# Altium project BytePipe_x9002_HDK_Release_Rev2.PrjPcb (part 2 of 2)

## Sheet 5-DisplayPort & Ethernet.SchDoc: DisplayPort & Ethernet
size B; CompanyName: NGRF; Address1: 2130 Howard Drive W; Address2: North Mankato, MN 56003; Address3: www.nextgenrf.com; Revision: 2; SheetNumber: 5; SheetTotal: 7; ProjName: BytePipe X9002_HDK
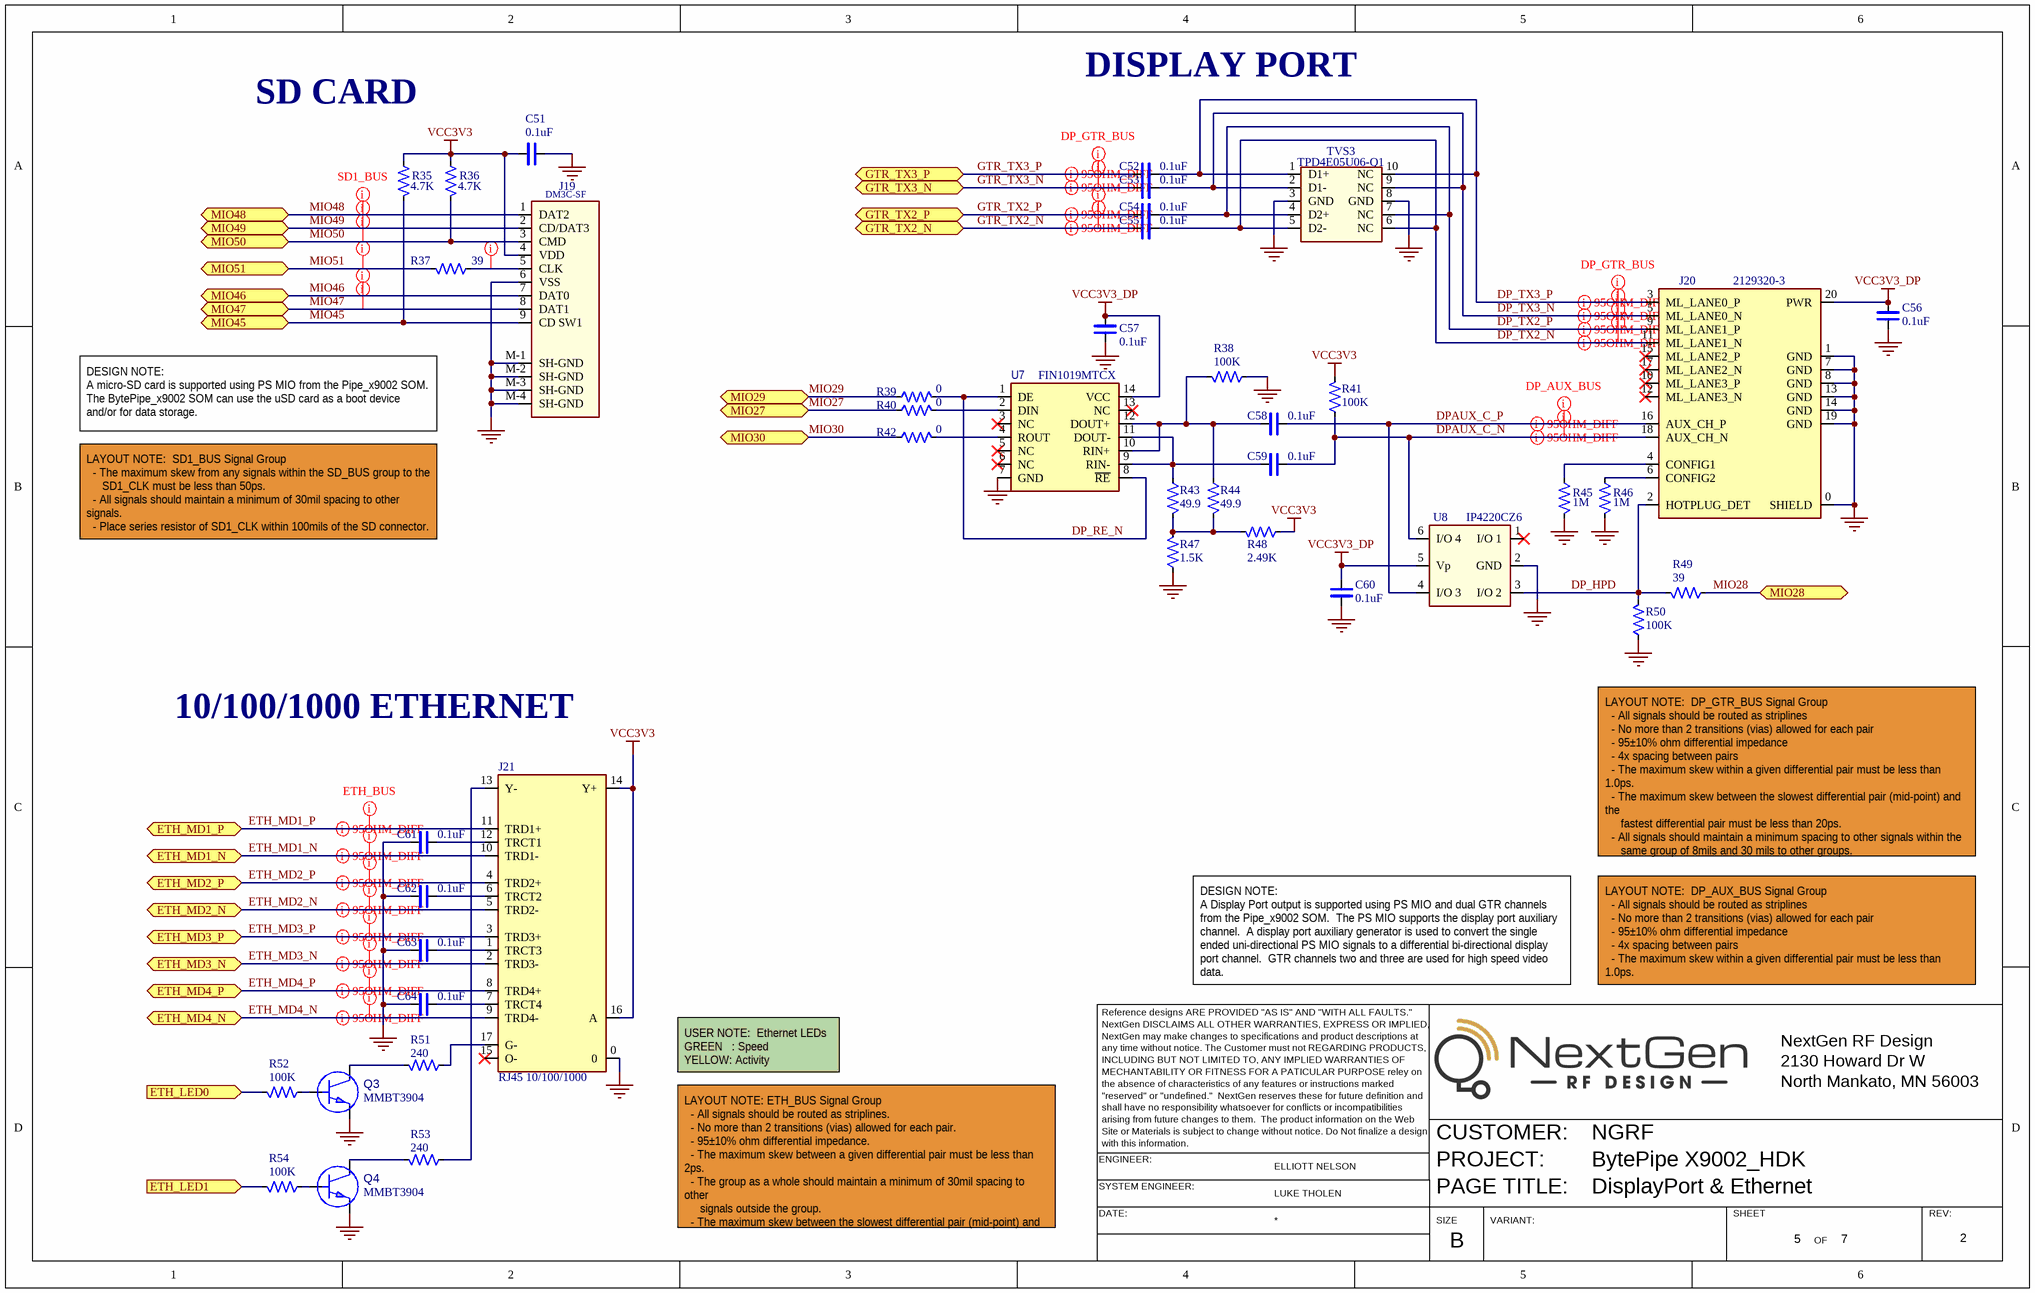
[diagram p4: 5-DisplayPort & Ethernet.SchDoc]

### Parts
C51  value 0.1uF  [SM/0402/CAP]  (hidden comment: CAP_CERAMIC_0402)
C52  value 0.1uF  [SM/0402/CAP]  (hidden comment: CAP_CERAMIC_0402)
C53  value 0.1uF  [SM/0402/CAP]  (hidden comment: CAP_CERAMIC_0402)
C54  value 0.1uF  [SM/0402/CAP]  (hidden comment: CAP_CERAMIC_0402)
C55  value 0.1uF  [SM/0402/CAP]  (hidden comment: CAP_CERAMIC_0402)
C56  value 0.1uF  [SM/0402/CAP]  (hidden comment: CAP_CERAMIC_0402)
C57  value 0.1uF  [SM/0402/CAP]  (hidden comment: CAP_CERAMIC_0402)
C58  value 0.1uF  [SM/0402/CAP]  (hidden comment: CAP_CERAMIC_0402)
C59  value 0.1uF  [SM/0402/CAP]  (hidden comment: CAP_CERAMIC_0402)
C60  value 0.1uF  [SM/0402/CAP]  (hidden comment: CAP_CERAMIC_0402)
C61  value 0.1uF  [SM/0402/CAP]  (hidden comment: CAP_CERAMIC_0402)
C62  value 0.1uF  [SM/0402/CAP]  (hidden comment: CAP_CERAMIC_0402)
C63  value 0.1uF  [SM/0402/CAP]  (hidden comment: CAP_CERAMIC_0402)
C64  value 0.1uF  [SM/0402/CAP]  (hidden comment: CAP_CERAMIC_0402)
J19  value DM3C-SF  [SM/CON/MICRO_SD-CARD/HOLDER]  (hidden comment: CONN MICRO SD CARD HINGED TYPE)
J20  value 2129320-3  [CON/TE/2129320-3]  (hidden comment: CON_TE_2129320-3)
J21  value RJ45 10/100/1000  [CON/RJ45/L829-1J1T-43]  (hidden comment: CON_RJ45_MagJack_L829-1J1T-43)
Q3  value MMBT3904  [SM/SOT23_A]  (hidden comment: TRANSISTOR_NPN_SOT23)
Q4  value MMBT3904  [SM/SOT23_A]  (hidden comment: TRANSISTOR_NPN_SOT23)
R35  value 4.7K  [SM/0402/RES]  (hidden comment: RES_0402_A)
R36  value 4.7K  [SM/0402/RES]  (hidden comment: RES_0402_A)
R37  value 39  [SM/0402/RES]  (hidden comment: RES_0402_A)
R38  value 100K  [SM/0402/RES]  (hidden comment: RES_0402_A)
R39  value 0  [SM/0402/RES]  (hidden comment: RES_0402_A)
R40  value 0  [SM/0402/RES]  (hidden comment: RES_0402_A)
R41  value 100K  [SM/0402/RES]  (hidden comment: RES_0402_A)
R42  value 0  [SM/0402/RES]  (hidden comment: RES_0402_A)
R43  value 49.9  [SM/0402/RES]  (hidden comment: RES_0402_A)
R44  value 49.9  [SM/0402/RES]  (hidden comment: RES_0402_A)
R45  value 1M  [SM/0402/RES]  (hidden comment: RES_0402_A)
R46  value 1M  [SM/0402/RES]  (hidden comment: RES_0402_A)
R47  value 1.5K  [SM/0402/RES]  (hidden comment: RES_0402_A)
R48  value 2.49K  [SM/0402/RES]  (hidden comment: RES_0402_A)
R49  value 39  [SM/0402/RES]  (hidden comment: RES_0402_A)
R50  value 100K  [SM/0402/RES]  (hidden comment: RES_0402_A)
R51  value 240  [SM/0402/RES]  (hidden comment: RES_0402_A)
R52  value 100K  [SM/0402/RES]  (hidden comment: RES_0402_A)
R53  value 240  [SM/0402/RES]  (hidden comment: RES_0402_A)
R54  value 100K  [SM/0402/RES]  (hidden comment: RES_0402_A)
TVS3  value TPD4E05U06-Q1  [SM/DFN10/2.5X1MM_A]  (hidden comment: TVS_TPD4E05U06_2.5mmX1mm)
U7  value FIN1019MTCX  [SM/TSSOP14_5X6.4MM_A]  (hidden comment: IC_FIN1019MTCX_TSSOP-14)
U8  value IP4220CZ6  [SM/TSOP-6_A]  (hidden comment: IC_IP4220CZ6_TSOP-6)

### Ports
ETH_LED0 (in), ETH_LED1 (in), ETH_MD1_N (bidir), ETH_MD1_P (bidir), ETH_MD2_N (bidir), ETH_MD2_P (bidir), ETH_MD3_N (bidir), ETH_MD3_P (bidir), ETH_MD4_N (bidir), ETH_MD4_P (bidir), GTR_TX2_N (bidir), GTR_TX2_P (bidir), GTR_TX3_N (bidir), GTR_TX3_P (bidir), MIO27 (bidir), MIO28 (bidir), MIO29 (bidir), MIO30 (bidir), MIO45 (bidir), MIO46 (bidir), MIO47 (bidir), MIO48 (bidir), MIO49 (bidir), MIO50 (bidir), MIO51 (bidir)

### Nets
GND: C51.2(N2) C56.2(N2) C57.2(N2) C60.2(N2) C61.1(N1) C62.1(N1) C63.1(N1) C64.1(N1) J19.6(VSS) J19.M-1(SH-GND) J19.M-2(SH-GND) J19.M-3(SH-GND) J19.M-4(SH-GND) J20.0(SHIELD) J20.1(GND) J20.7(GND) J20.8(GND) J20.13(GND) J20.14(GND) J20.19(GND) J21.0 Q3.2(E) Q4.2(E) R38.1 R45.2 R46.2 R47.1 R50.1 TVS3.3(GND) TVS3.8(GND) U7.7(GND) U8.2(GND)
VCC3V3: C51.1(N1) J19.4(VDD) J21.14(Y+) J21.16(A) R35.1 R36.1 R41.2 R48.1
VCC3V3_DP: C56.1(N1) C57.1(N1) C60.1(N1) J20.20(PWR) U7.14(VCC) U8.5(Vp)
DP_HPD: J20.2(HOTPLUG_DET) R49.2 R50.2 U8.3(I/O_2)
DP_RE_N: R39.1 U7.1(DE) U7.8(~{RE})
DP_TX2_N: C55.2(N2) J20.11(ML_LANE1_N) TVS3.5(D2-) TVS3.6(NC)
DP_TX2_P: C54.2(N2) J20.9(ML_LANE1_P) TVS3.4(D2+) TVS3.7(NC)
DP_TX3_N: C53.2(N2) J20.5(ML_LANE0_N) TVS3.2(D1-) TVS3.9(NC)
DP_TX3_P: C52.2(N2) J20.3(ML_LANE0_P) TVS3.1(D1+) TVS3.10(NC)
DPAUX_C_N: C59.2(N2) J20.18(AUX_CH_N) R41.1 U8.6(I/O_4)
DPAUX_C_P: C58.2(N2) J20.16(AUX_CH_P) U8.4(I/O_3)
ETH_LED0: R52.2 ; port ETH_LED0
ETH_LED1: R54.2 ; port ETH_LED1
ETH_MD1_N: J21.10(TRD1-) ; port ETH_MD1_N
ETH_MD1_P: J21.11(TRD1+) ; port ETH_MD1_P
ETH_MD2_N: J21.5(TRD2-) ; port ETH_MD2_N
ETH_MD2_P: J21.4(TRD2+) ; port ETH_MD2_P
ETH_MD3_N: J21.2(TRD3-) ; port ETH_MD3_N
ETH_MD3_P: J21.3(TRD3+) ; port ETH_MD3_P
ETH_MD4_N: J21.9(TRD4-) ; port ETH_MD4_N
ETH_MD4_P: J21.8(TRD4+) ; port ETH_MD4_P
GTR_TX2_N: C55.1(N1) ; port GTR_TX2_N
GTR_TX2_P: C54.1(N1) ; port GTR_TX2_P
GTR_TX3_N: C53.1(N1) ; port GTR_TX3_N
GTR_TX3_P: C52.1(N1) ; port GTR_TX3_P
MIO27: R40.2 ; port MIO27
MIO28: R49.1 ; port MIO28
MIO29: R39.2 ; port MIO29
MIO30: R42.2 ; port MIO30
MIO45: J19.9(CD_SW1) R35.2 ; port MIO45
MIO46: J19.7(DAT0) ; port MIO46
MIO47: J19.8(DAT1) ; port MIO47
MIO48: J19.1(DAT2) ; port MIO48
MIO49: J19.2(CD/DAT3) ; port MIO49
MIO50: J19.3(CMD) R36.2 ; port MIO50
MIO51: R37.2 ; port MIO51
NetC58_1: C58.1(N1) R38.2 R44.1 U7.10(RIN+) U7.12(DOUT+)
NetC59_1: C59.1(N1) R43.1 U7.9(RIN-) U7.11(DOUT-)
NetC61_2: C61.2(N2) J21.12(TRCT1)
NetC62_2: C62.2(N2) J21.6(TRCT2)
NetC63_2: C63.2(N2) J21.1(TRCT3)
NetC64_2: C64.2(N2) J21.7(TRCT4)
NetJ19_5: J19.5(CLK) R37.1
NetJ20_4: J20.4(CONFIG1) R45.1
NetJ20_6: J20.6(CONFIG2) R46.1
NetJ21_13: J21.13(Y-) R53.2
NetJ21_17: J21.17(G-) R51.2
NetQ3_1: Q3.1(B) R52.1
NetQ3_3: Q3.3(C) R51.1
NetQ4_1: Q4.1(B) R54.1
NetQ4_3: Q4.3(C) R53.1
NetR40_1: R40.1 U7.2(DIN)
NetR42_1: R42.1 U7.4(ROUT)
NetR43_2: R43.2 R44.2 R47.2 R48.2

Not connected (* = marked no-connect by the designer): J20 10(ML_LANE3_P)* 12(ML_LANE3_N)* 15(ML_LANE2_P)* 17(ML_LANE2_N)*; J21 15(O-)*; U7 3(NC)* 5(NC)* 6(NC)* 13(NC)*; U8 1(I/O_1)*

### Layout directives
net class DP_GTR_BUS: DP_TX2_N, DP_TX2_P, DP_TX3_N, DP_TX3_P, GTR_TX2_N, GTR_TX2_P, GTR_TX3_N, GTR_TX3_P
net class DP_AUX_BUS: DPAUX_C_N, DPAUX_C_P
differential pair; Impedance: 90 Ohms; differential pair class 95OHM_DIFF: DP_TX2_N, DP_TX2_P, DP_TX3_N, DP_TX3_P, DPAUX_C_N, DPAUX_C_P, ETH_MD1_N, ETH_MD1_P, ETH_MD2_N, ETH_MD2_P, ETH_MD3_N, ETH_MD3_P, ETH_MD4_N, ETH_MD4_P, GTR_TX2_N, GTR_TX2_P, GTR_TX3_N, GTR_TX3_P
net class ETH_BUS: ETH_MD1_N, ETH_MD1_P, ETH_MD2_N, ETH_MD2_P, ETH_MD3_N, ETH_MD3_P, ETH_MD4_N, ETH_MD4_P
net class SD1_BUS: MIO46, MIO47, MIO48, MIO49, MIO50, MIO51, NetJ19_5

### Notes on the sheet
- DISPLAY PORT
- SD CARD
- DESIGN NOTE:
  A micro-SD card is supported using PS MIO from the Pipe_x9002 SOM.  The BytePipe_x9002 SOM can use the uSD card as a boot device and/or for data storage.
- LAYOUT NOTE:  SD1_BUS Signal Group
  - The maximum skew from any signals within the SD_BUS group to the
  SD1_CLK must be less than 50ps.
  - All signals should maintain a minimum of 30mil spacing to other signals.
  - Place series resistor of SD1_CLK within 100mils of the SD connector.
  -MIO51 is SD1_CLK.
- 10/100/1000 ETHERNET
- (near R50) LAYOUT NOTE:  DP_GTR_BUS Signal Group
  - All signals should be routed as striplines
  - No more than 2 transitions (vias) allowed for each pair
  - 95±10% ohm differential impedance
  - 4x spacing between pairs
  - The maximum skew within a given differential pair must be less than 1.0ps.
  - The maximum skew between the slowest differential pair (mid-point) and the
  fastest differential pair must be less than 20ps.
  - All signals should maintain a minimum spacing to other signals within the
  same group of 8mils and 30 mils to other groups.
  - All signals within the group should be routed on the same layer.
- Reference designs ARE PROVIDED "AS IS" AND "WITH ALL FAULTS."
- NextGen DISCLAIMS ALL OTHER WARRANTIES, EXPRESS OR IMPLIED,
- NextGen may make changes to specifications and product descriptions at
- DESIGN NOTE:
  A Display Port output is supported using PS MIO and dual GTR channels from the Pipe_x9002 SOM.  The PS MIO supports the display port auxiliary channel.  A display port auxiliary generator is used to convert the single ended uni-directional PS MIO signals to a differential bi-directional display port channel.  GTR channels two and three are used for high speed video data.
- LAYOUT NOTE:  DP_AUX_BUS Signal Group
  - All signals should be routed as striplines
  - No more than 2 transitions (vias) allowed for each pair
  - 95±10% ohm differential impedance
  - 4x spacing between pairs
  - The maximum skew within a given differential pair must be less than 1.0ps.
- NextGen RF Design
- USER NOTE:  Ethernet LEDs
  GREEN   : Speed
  YELLOW: Activity
- any time without notice. The Customer must not REGARDING PRODUCTS,
- INCLUDING BUT NOT LIMITED TO, ANY IMPLIED WARRANTIES OF
- MECHANTABILITY OR FITNESS FOR A PATICULAR PURPOSE reley on
- "reserved" or "undefined."  NextGen reserves these for future definition and
- the absence of characteristics of any features or instructions marked
- shall have no responsibility whatsoever for conflicts or incompatibilities
- 2130 Howard Dr W
- North Mankato, MN 56003
- ENGINEER:
- Site or Materials is subject to change without notice. Do Not finalize a design
- with this information.
- arising from future changes to them.  The product information on the Web
- ELLIOTT NELSON
- CUSTOMER:
- PROJECT:
- LAYOUT NOTE: ETH_BUS Signal Group
  - All signals should be routed as striplines.
  - No more than 2 transitions (vias) allowed for each pair.
  - 95±10% ohm differential impedance.
  - The maximum skew between a given differential pair must be less than 2ps.
  - The group as a whole should maintain a minimum of 30mil spacing to other
  signals outside the group.
  - The maximum skew between the slowest differential pair (mid-point) and the
  fastest differential pair of the signal group must be less than 10ps.
- SYSTEM ENGINEER:
- DATE:
- LUKE THOLEN
- SIZE
- PAGE TITLE:
- VARIANT:
- SHEET
- OF
- REV:
- B

### Library data of the parts
C51-C64 = CAP_CERAMIC_0402: CAP CER 0.1UF 25V X7R 0402; TOL: ±10%; OEM#: CL05B104KA5NNNC; OEM NAME: Samsung; VOLT: 25V
J19 = CON_HIROSE_MICRO-SD_HINGED: 10 (8 + 2) Position Card Connector Secure Digital - microSD™ Surface Mount, Right Angle Gold; OEM NAME: Hirose Electric Co Ltd; OEM#: DM3C-SF
J20 = CON_TE_2129320-3: DisplayPort, Mini  Receptacle Connector 20 Position Through Hole, Right Angle..; OEM NAME: TE; OEM#: 2129320-3
J21 = CON_RJ45_MagJack_L829-1J1T-43: 1 Port RJ45 Magjack Connector Through Hole 10/100/1000 Base-T, AutoMDIX; OEM NAME: Bel Fuse Inc; OEM#: L829-1J1T-43
Q3 Q4 = TRANSISTOR_NPN_SOT23: Bipolar (BJT) Transistor NPN 40V 200mA 300MHz 300mW Surface Mount SOT-23-3 (TO-236); OEM#: MMBT3904LT1G; OEM NAME: ON Semiconductor
R35 R36 = RES_0402_A: RES SMD 4.7K OHM 1% 1/10W 0402; OEM#: ERJ-2RKF4701X; OEM NAME: Panasonic; TOL: 1%
R37 R49 = RES_0402_A: RES SMD 39 OHM 1% 1/10W 0402; OEM#: ERJ-2RKF39R0X; OEM NAME: Panasonic; TOL: 1%
R38 R41 R50 R52 R54 = RES_0402_A: RES SMD 100K OHM 1% 1/10W 0402; OEM#: ERJ-2RKF1003X; OEM NAME: Panasonic; TOL: 1%
R39 R40 R42 = RES_0402_A: RES SMD 0 OHM JUMPER 1/10W 0402; OEM#: ERJ-2GE0R00X; OEM NAME: Panasonic; TOL: 1%
R43 R44 = RES_0402_A: RES 49.9 OHM 1% 1/10W 0402; OEM#: ERJ-2RKF49R9X; OEM NAME: Panasonic; TOL: ±1%
R45 R46 = RES_0402_A: RES SMD 1M OHM 1% 1/10W 0402; OEM#: ERJ-2RKF1004X; OEM NAME: Panasonic; TOL: ±1%
R47 = RES_0402_A: RES SMD 1.5K OHM 1% 1/10W 0402; OEM#: ERJ-2RKF1501X; OEM NAME: Panasonic; TOL: ±1%
R48 = RES_0402_A: RES SMD 2.49K OHM 1% 1/10W 0402; OEM#: ERJ-2RKF2491X; OEM NAME: Panasonic; TOL: ±1%
R51 R53 = RES_0402_A: RES SMD 240 OHM 1% 1/10W 0402; OEM#: ERJ-2RKF2400X; OEM NAME: Panasonic; TOL: 1%
TVS3 = TVS_TPD4E05U06_2.5mmX1mm: TVS DIODE 5.5V 14V 10SON; OEM NAME: TI; OEM#: TPD4E05U06-Q1
U7 = IC_FIN1019MTCX_TSSOP-14: 1/1 Transceiver Full LVDS 14-TSSOP; OEM NAME: ON Semiconductor; OEM#: FIN1019MTCX
U8 = IC_IP4220CZ6_TSOP-6: Dual USB ESD Protection; OEM#: IP4220CZ6,125; OEM NAME: NXP

## Sheet 6-User IO.SchDoc: User I/O
size B; CompanyName: NGRF; Address1: 2130 Howard Drive W; Address2: North Mankato, MN 56003; Address3: www.nextgenrf.com; Revision: 2; SheetNumber: 6; SheetTotal: 7; ProjName: BytePipe X9002_HDK
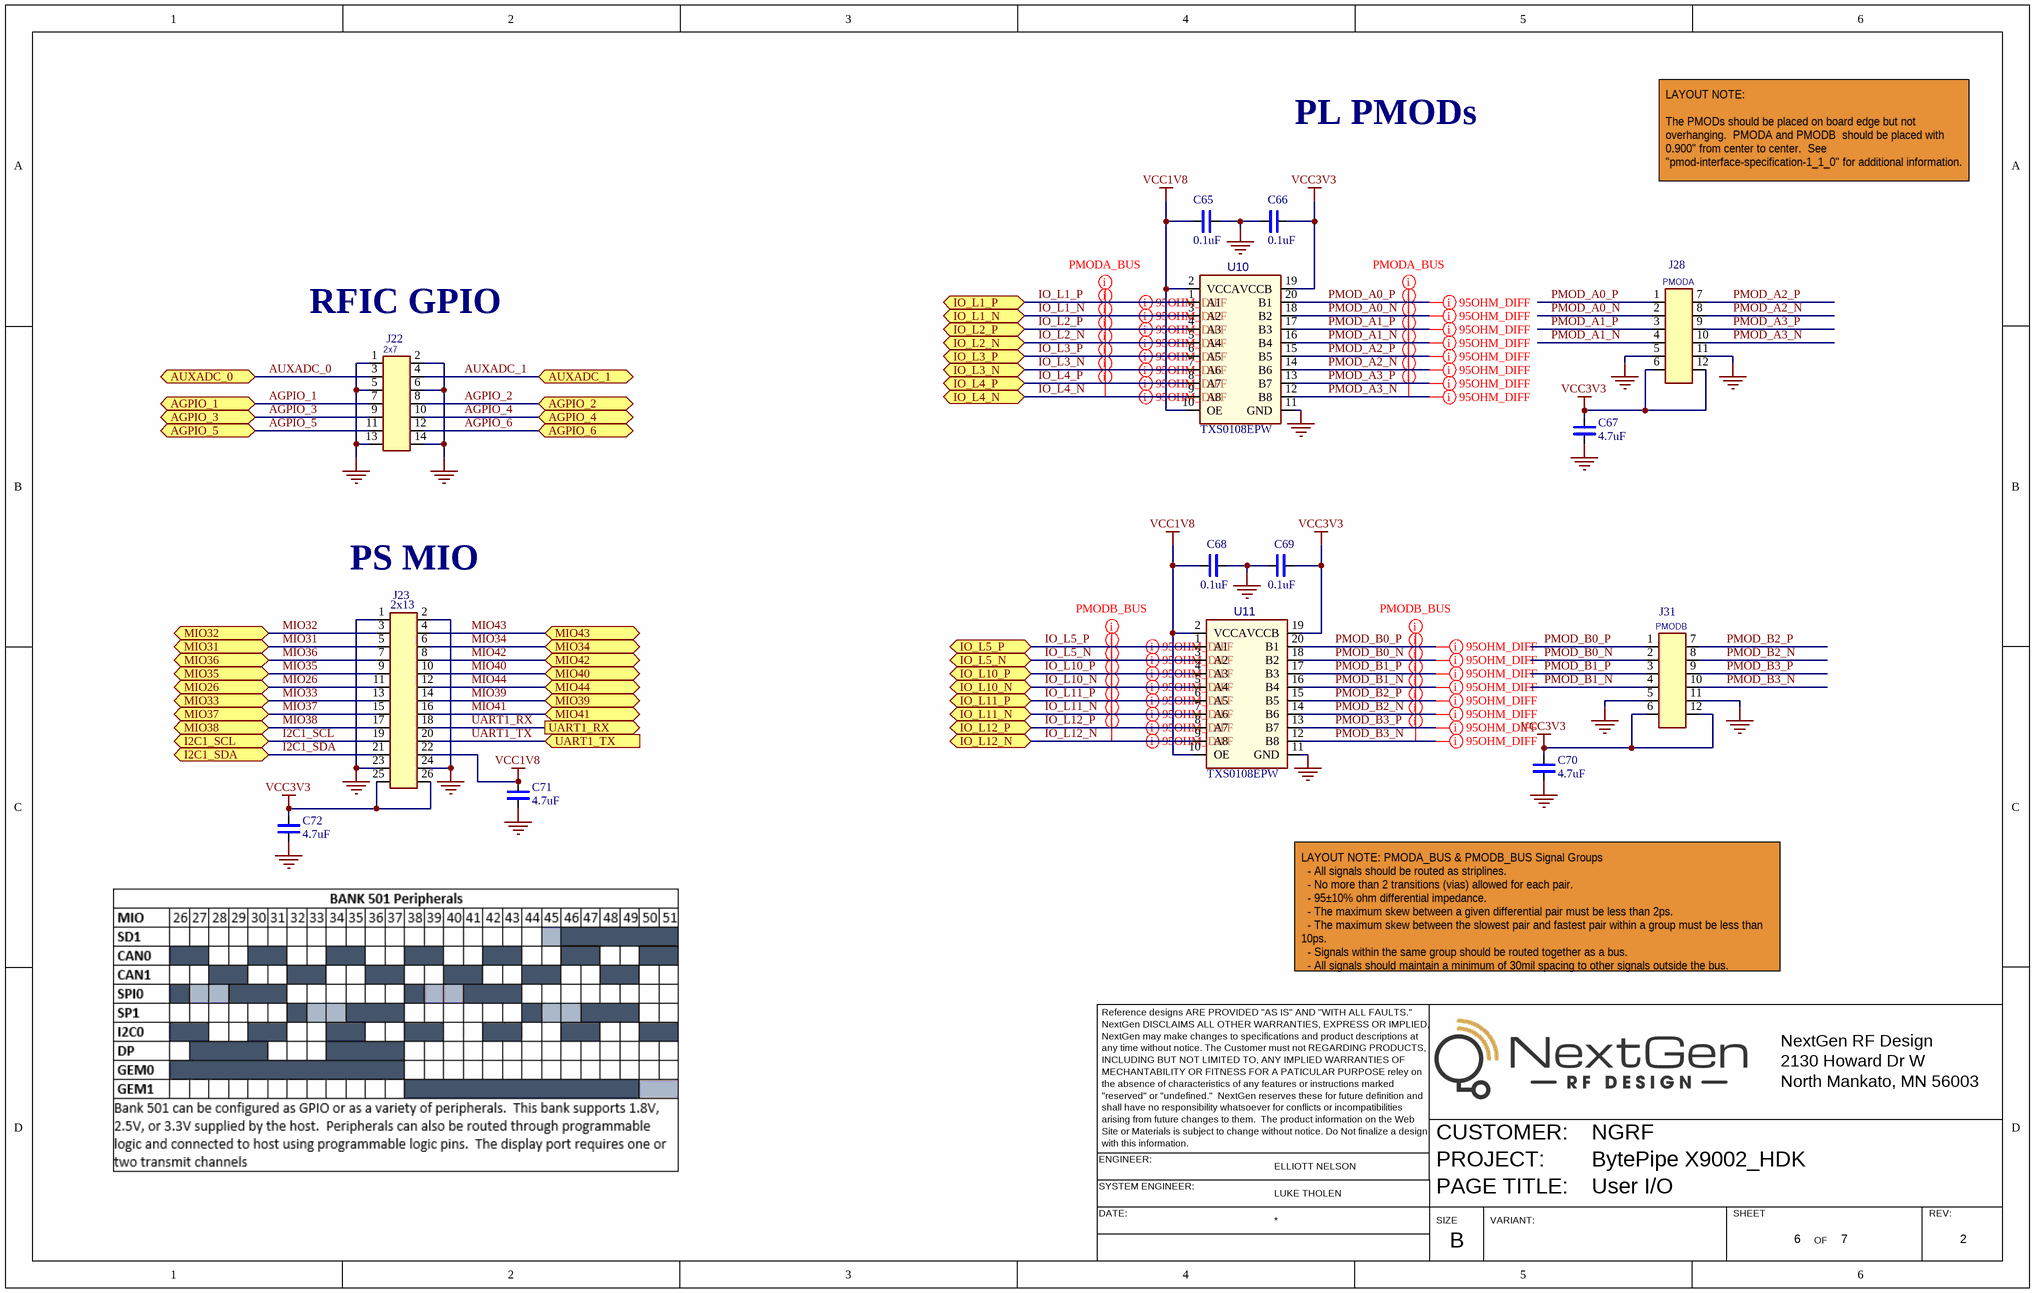
[diagram p5: 6-User IO.SchDoc]

### Parts
C65  value 0.1uF  [SM/0402/CAP]  (hidden comment: CAP_CERAMIC_0402)
C66  value 0.1uF  [SM/0402/CAP]  (hidden comment: CAP_CERAMIC_0402)
C67  value 4.7uF  [SM/0402/CAP]  (hidden comment: CAP_CERAMIC_0402)
C68  value 0.1uF  [SM/0402/CAP]  (hidden comment: CAP_CERAMIC_0402)
C69  value 0.1uF  [SM/0402/CAP]  (hidden comment: CAP_CERAMIC_0402)
C70  value 4.7uF  [SM/0402/CAP]  (hidden comment: CAP_CERAMIC_0402)
C71  value 4.7uF  [SM/0402/CAP]  (hidden comment: CAP_CERAMIC_0402)
C72  value 4.7uF  [SM/0402/CAP]  (hidden comment: CAP_CERAMIC_0402)
J22  value 2x7  [CON/100SP/2X7P/VT/038_A]  (hidden comment: CON_100SP_2X7P_VT)
J23  value 2x13  [CON/100SP/2X13P/038_A]  (hidden comment: CON_100SP_2X13P_VERT)
J28  value PMODA  [CON/SAMTEC/SSW/2X6/RA_A/PMOD]  (hidden comment: CON_100SP_2X6P_RA_PMOD)
J31  value PMODB  [CON/SAMTEC/SSW/2X6/RA_A/PMOD]  (hidden comment: CON_100SP_2X6P_RA_PMOD)
U10  value TXS0108EPW  [SM/TSSOP20_6.5X6.4MM]  (hidden comment: IC_TXS0108_TSSOP-20)
U11  value TXS0108EPW  [SM/TSSOP20_6.5X6.4MM]  (hidden comment: IC_TXS0108_TSSOP-20)

### Ports
AGPIO_1 (bidir), AGPIO_2 (bidir), AGPIO_3 (bidir), AGPIO_4 (bidir), AGPIO_5 (bidir), AGPIO_6 (bidir), AUXADC_0 (bidir), AUXADC_1 (bidir), I2C1_SCL (bidir), I2C1_SDA (bidir), IO_L1_N (bidir), IO_L1_P (bidir), IO_L2_N (bidir), IO_L2_P (bidir), IO_L3_N (bidir), IO_L3_P (bidir), IO_L4_N (bidir), IO_L4_P (bidir), IO_L5_N (bidir), IO_L5_P (bidir), IO_L10_N (bidir), IO_L10_P (bidir), IO_L11_N (bidir), IO_L11_P (bidir), IO_L12_N (bidir), IO_L12_P (bidir), MIO26 (bidir), MIO31 (bidir), MIO32 (bidir), MIO33 (bidir), MIO34 (bidir), MIO35 (bidir), MIO36 (bidir), MIO37 (bidir), MIO38 (bidir), MIO39 (bidir), MIO40 (bidir), MIO41 (bidir), MIO42 (bidir), MIO43 (bidir), MIO44 (bidir), UART1_RX (out), UART1_TX (in)

### Nets
GND: C65.2(N2) C66.1(N1) C67.2(N2) C68.2(N2) C69.1(N1) C70.2(N2) C71.2(N2) C72.2(N2) J22.1(N1) J22.2(N2) J22.5(N5) J22.6(N6) J22.13(N13) J22.14(N14) J23.1(N1) J23.2(N2) J23.23(N23) J23.24(N24) J28.5(N5) J28.11(N11) J31.5(N5) J31.11(N11) U10.11(GND) U11.11(GND)
VCC1V8: C65.1(N1) C68.1(N1) C71.1(N1) J23.22(N22) U10.2(VCCA) U10.10(OE) U11.2(VCCA) U11.10(OE)
VCC3V3: C66.2(N2) C67.1(N1) C69.2(N2) C70.1(N1) C72.1(N1) J23.25(N25) J23.26(N26) J28.6(N6) J28.12(N12) J31.6(N6) J31.12(N12) U10.19(VCCB) U11.19(VCCB)
AGPIO_1: J22.7(N7) ; port AGPIO_1
AGPIO_2: J22.8(N8) ; port AGPIO_2
AGPIO_3: J22.9(N9) ; port AGPIO_3
AGPIO_4: J22.10(N10) ; port AGPIO_4
AGPIO_5: J22.11(N11) ; port AGPIO_5
AGPIO_6: J22.12(N12) ; port AGPIO_6
AUXADC_0: J22.3(N3) ; port AUXADC_0
AUXADC_1: J22.4(N4) ; port AUXADC_1
I2C1_SCL: J23.19(N19) ; port I2C1_SCL
I2C1_SDA: J23.21(N21) ; port I2C1_SDA
IO_L1_N: U10.3(A2) ; port IO_L1_N
IO_L1_P: U10.1(A1) ; port IO_L1_P
IO_L2_N: U10.5(A4) ; port IO_L2_N
IO_L2_P: U10.4(A3) ; port IO_L2_P
IO_L3_N: U10.7(A6) ; port IO_L3_N
IO_L3_P: U10.6(A5) ; port IO_L3_P
IO_L4_N: U10.9(A8) ; port IO_L4_N
IO_L4_P: U10.8(A7) ; port IO_L4_P
IO_L5_N: U11.3(A2) ; port IO_L5_N
IO_L5_P: U11.1(A1) ; port IO_L5_P
IO_L10_N: U11.5(A4) ; port IO_L10_N
IO_L10_P: U11.4(A3) ; port IO_L10_P
IO_L11_N: U11.7(A6) ; port IO_L11_N
IO_L11_P: U11.6(A5) ; port IO_L11_P
IO_L12_N: U11.9(A8) ; port IO_L12_N
IO_L12_P: U11.8(A7) ; port IO_L12_P
MIO26: J23.11(N11) ; port MIO26
MIO31: J23.5(N5) ; port MIO31
MIO32: J23.3(N3) ; port MIO32
MIO33: J23.13(N13) ; port MIO33
MIO34: J23.6(N6) ; port MIO34
MIO35: J23.9(N9) ; port MIO35
MIO36: J23.7(N7) ; port MIO36
MIO37: J23.15(N15) ; port MIO37
MIO38: J23.17(N17) ; port MIO38
MIO39: J23.14(N14) ; port MIO39
MIO40: J23.10(N10) ; port MIO40
MIO41: J23.16(N16) ; port MIO41
MIO42: J23.8(N8) ; port MIO42
MIO43: J23.4(N4) ; port MIO43
MIO44: J23.12(N12) ; port MIO44
PMOD_A0_N: J28.2(N2) U10.18(B2)
PMOD_A0_P: J28.1(N1) U10.20(B1)
PMOD_A1_N: J28.4(N4) U10.16(B4)
PMOD_A1_P: J28.3(N3) U10.17(B3)
PMOD_A2_N: J28.8(N8) U10.14(B6)
PMOD_A2_P: J28.7(N7) U10.15(B5)
PMOD_A3_N: J28.10(N10) U10.12(B8)
PMOD_A3_P: J28.9(N9) U10.13(B7)
PMOD_B0_N: J31.2(N2) U11.18(B2)
PMOD_B0_P: J31.1(N1) U11.20(B1)
PMOD_B1_N: J31.4(N4) U11.16(B4)
PMOD_B1_P: J31.3(N3) U11.17(B3)
PMOD_B2_N: J31.8(N8) U11.14(B6)
PMOD_B2_P: J31.7(N7) U11.15(B5)
PMOD_B3_N: J31.10(N10) U11.12(B8)
PMOD_B3_P: J31.9(N9) U11.13(B7)
UART1_RX: J23.18(N18) ; port UART1_RX
UART1_TX: J23.20(N20) ; port UART1_TX

### Layout directives
net class PMODA_BUS: IO_L1_N, IO_L1_P, IO_L2_N, IO_L2_P, IO_L3_N, IO_L3_P, IO_L4_N, IO_L4_P, PMOD_A0_N, PMOD_A0_P, PMOD_A1_N, PMOD_A1_P, PMOD_A2_N, PMOD_A2_P, PMOD_A3_N, PMOD_A3_P
differential pair; Impedance: 90 Ohms; differential pair class 95OHM_DIFF: IO_L1_N, IO_L1_P, IO_L2_N, IO_L2_P, IO_L3_N, IO_L3_P, IO_L4_N, IO_L4_P, IO_L5_N, IO_L5_P, IO_L10_N, IO_L10_P, IO_L11_N, IO_L11_P, IO_L12_N, IO_L12_P, PMOD_A0_N, PMOD_A0_P, PMOD_A1_N, PMOD_A1_P, PMOD_A2_N, PMOD_A2_P, PMOD_A3_N, PMOD_A3_P, PMOD_B0_N, PMOD_B0_P, PMOD_B1_N, PMOD_B1_P, PMOD_B2_N, PMOD_B2_P, PMOD_B3_N, PMOD_B3_P
net class PMODB_BUS: IO_L5_N, IO_L5_P, IO_L10_N, IO_L10_P, IO_L11_N, IO_L11_P, IO_L12_N, IO_L12_P, PMOD_B0_N, PMOD_B0_P, PMOD_B1_N, PMOD_B1_P, PMOD_B2_N, PMOD_B2_P, PMOD_B3_N, PMOD_B3_P

### Notes on the sheet
- PL PMODs
- LAYOUT NOTE:
  The PMODs should be placed on board edge but not overhanging.  PMODA and PMODB  should be placed with 0.900" from center to center.  See "pmod-interface-specification-1_1_0" for additional information.
- (near J22) RFIC GPIO
- (near J23) PS MIO
- LAYOUT NOTE: PMODA_BUS & PMODB_BUS Signal Groups
  - All signals should be routed as striplines.
  - No more than 2 transitions (vias) allowed for each pair.
  - 95±10% ohm differential impedance.
  - The maximum skew between a given differential pair must be less than 2ps.
  - The maximum skew between the slowest pair and fastest pair within a group must be less than 10ps.
  - Signals within the same group should be routed together as a bus.
  - All signals should maintain a minimum of 30mil spacing to other signals outside the bus.
- Reference designs ARE PROVIDED "AS IS" AND "WITH ALL FAULTS."
- NextGen DISCLAIMS ALL OTHER WARRANTIES, EXPRESS OR IMPLIED,
- NextGen may make changes to specifications and product descriptions at
- NextGen RF Design
- any time without notice. The Customer must not REGARDING PRODUCTS,
- INCLUDING BUT NOT LIMITED TO, ANY IMPLIED WARRANTIES OF
- MECHANTABILITY OR FITNESS FOR A PATICULAR PURPOSE reley on
- "reserved" or "undefined."  NextGen reserves these for future definition and
- the absence of characteristics of any features or instructions marked
- shall have no responsibility whatsoever for conflicts or incompatibilities
- 2130 Howard Dr W
- North Mankato, MN 56003
- ENGINEER:
- Site or Materials is subject to change without notice. Do Not finalize a design
- with this information.
- arising from future changes to them.  The product information on the Web
- ELLIOTT NELSON
- CUSTOMER:
- PROJECT:
- SYSTEM ENGINEER:
- DATE:
- LUKE THOLEN
- SIZE
- PAGE TITLE:
- VARIANT:
- SHEET
- OF
- REV:
- B

### Library data of the parts
C65 C66 C68 C69 = CAP_CERAMIC_0402: as C51-C64 on sheet 5-DisplayPort & Ethernet; VOLT: 25V
C67 C70-C72 = CAP_CERAMIC_0402: CAP CER 4.7UF 10V X5R 0402; TOL: ±20%; OEM#: CL05A475MP5NRNC; OEM NAME: Samsung; VOLT: 10V
J22 = CON_100SP_2X7P_VT: Connector Header Through Hole 14 position 0.100" (2.54mm); OEM#: 2011-2X07TSB; OEM NAME: Harwin Inc.
J23 = CON_100SP_2X13P_VERT: PIN HEADER, DOUBLE ROW 26 PIN, S; OEM#: M20-9981345; OEM NAME: Harwin Inc.
J28 J31 = CON_100SP_2X6P_RA_PMOD: Header, 100 mil, 2x6, Right Angle, PMOD pin out.; OEM#: SSW-106-02-T-D-RA; OEM NAME: SAMTEC
U10 U11 = IC_TXS0108_TSSOP-20: IC TRNSLTR BIDIRECTIONAL 20VQFN; OEM NAME: Texas Instruments; OEM#: TXS0108EPW

## Sheet 7-JTAG & Power.SchDoc: JTAG & Power
size B; CompanyName: NGRF; Address1: 2130 Howard Drive W; Address2: North Mankato, MN 56003; Address3: www.nextgenrf.com; Revision: 2; SheetNumber: 7; SheetTotal: 7; ProjName: BytePipe X9002_HDK; SystemEngineer: ELLIOT NELSON
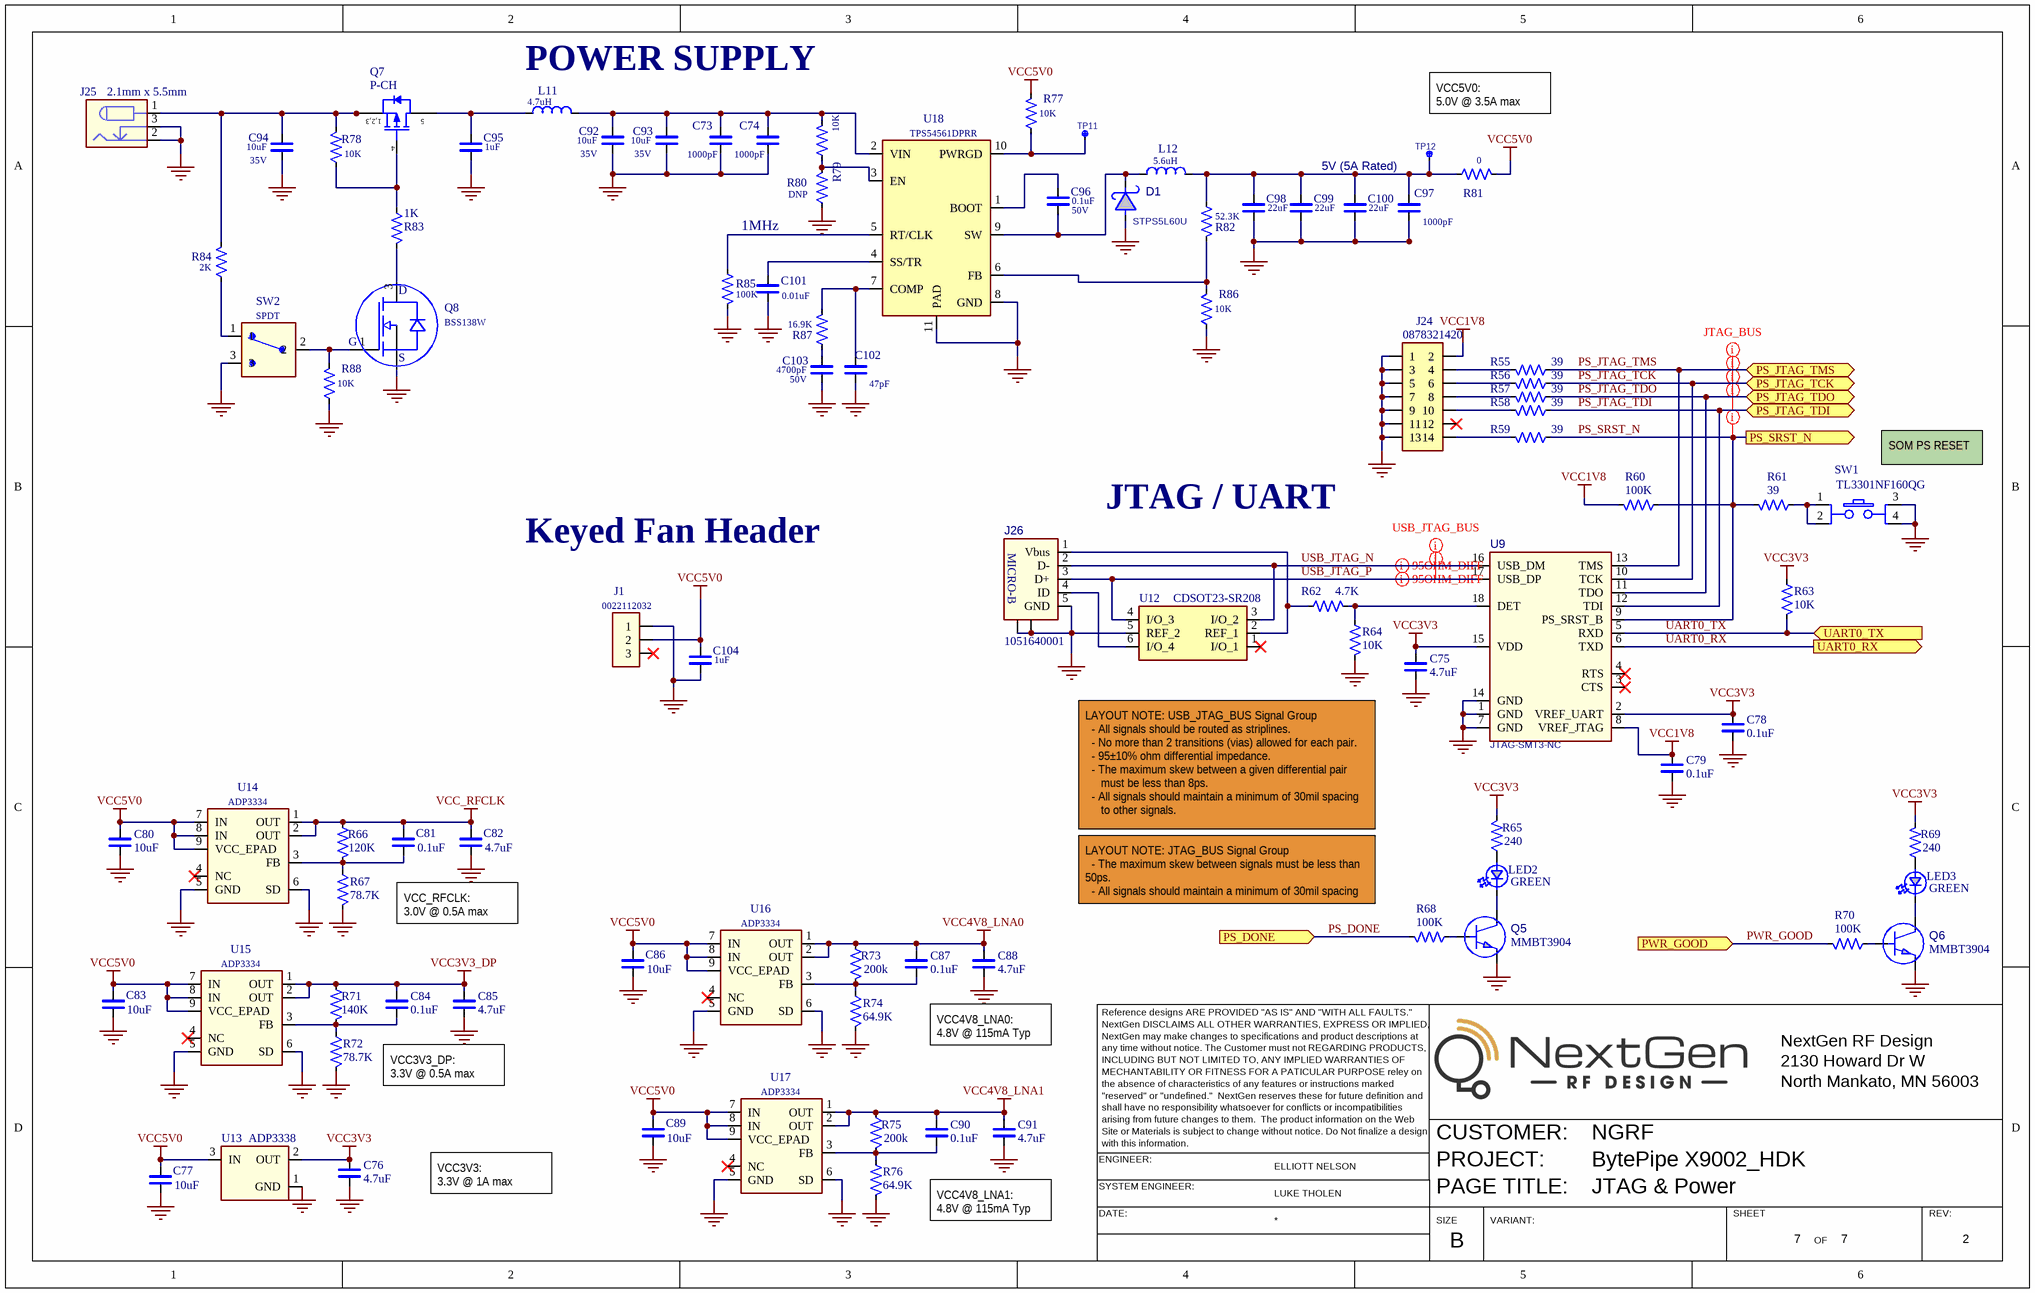
[diagram p6: 7-JTAG & Power.SchDoc]

### Parts
C73  value 1000pF  [SM/0402/CAP]
C74  value 1000pF  [SM/0402/CAP]
C75  value 4.7uF  [SM/0402/CAP]  (hidden comment: CAP_CERAMIC_0402)
C76  value 4.7uF  [SM/0402/CAP]  (hidden comment: CAP_CERAMIC_0402)
C77  value 10uF  [SM/0402/CAP]  (hidden comment: CAP_CERAMIC_0402)
C78  value 0.1uF  [SM/0402/CAP]  (hidden comment: CAP_CERAMIC_0402)
C79  value 0.1uF  [SM/0402/CAP]  (hidden comment: CAP_CERAMIC_0402)
C80  value 10uF  [SM/0402/CAP]  (hidden comment: CAP_CERAMIC_0402)
C81  value 0.1uF  [SM/0402/CAP]  (hidden comment: CAP_CERAMIC_0402)
C82  value 4.7uF  [SM/0402/CAP]  (hidden comment: CAP_CERAMIC_0402)
C83  value 10uF  [SM/0402/CAP]  (hidden comment: CAP_CERAMIC_0402)
C84  value 0.1uF  [SM/0402/CAP]  (hidden comment: CAP_CERAMIC_0402)
C85  value 4.7uF  [SM/0402/CAP]  (hidden comment: CAP_CERAMIC_0402)
C86  value 10uF  [SM/0402/CAP]  (hidden comment: CAP_CERAMIC_0402)
C87  value 0.1uF  [SM/0402/CAP]  (hidden comment: CAP_CERAMIC_0402)
C88  value 4.7uF  [SM/0402/CAP]  (hidden comment: CAP_CERAMIC_0402)
C89  value 10uF  [SM/0402/CAP]  (hidden comment: CAP_CERAMIC_0402)
C90  value 0.1uF  [SM/0402/CAP]  (hidden comment: CAP_CERAMIC_0402)
C91  value 4.7uF  [SM/0402/CAP]  (hidden comment: CAP_CERAMIC_0402)
C92  value 10uF  VOLT: 35V  [SM/0805/CAP]  (hidden comment: CAP_CERAMIC_0805)
C93  value 10uF  VOLT: 35V  [SM/0805/CAP]  (hidden comment: CAP_CERAMIC_0805)
C94  value 10uF  VOLT: 35V  [SM/0805/CAP]  (hidden comment: CAP_CERAMIC_0805)
C95  value 1uF  [SM/0603/CAP]  (hidden comment: CAP_CERAMIC_0603)
C96  value 0.1uF  VOLT: 50V  [SM/0402/CAP]  (hidden comment: CAP_CERAMIC_0402)
C97  value 1000pF  [SM/0402/CAP]
C98  value 22uF  [SM/0805/CAP]  (hidden comment: CAP_CERAMIC_0805)
C99  value 22uF  [SM/0805/CAP]  (hidden comment: CAP_CERAMIC_0805)
C100  value 22uF  [SM/0805/CAP]  (hidden comment: CAP_CERAMIC_0805)
C101  value 0.01uF  [SM/0402/CAP]
C102  value 47pF  [SM/0402/CAP]
C103  value 4700pF  VOLT: 50V  [SM/0402/CAP]
C104  value 1uF  [SM/0603/CAP]  (hidden comment: CAP_CERAMIC_0603)
D1  value STPS5L60U  [SM/DO-214AA/SMB_A]  (hidden comment: DIODE_SCHOTTKY SMB)
J1  0022112032  [CON/MLX/0022112032/3P]
J24  value 0878321420  [SM/CON/MLX/0878321420]  (hidden comment: CON_MOLEX_0878321420_14P)
J25  value 2.1mm x 5.5mm  [CON/WURTH/694106301002]  (hidden comment: CON_WURTH_694106301002)
J26  value 1051640001  [SM/CON/USB/MICRO B RA]  (hidden comment: CON_USB_MICRO-B_RA)
L11  value 4.7uH  [SM/IND/COILCRAFT/XAL4020]  (hidden comment: IND_COILCRAFT_XAL4020)
L12  value 5.6uH  [SM/IND/COILCRAFT/XAL7030]  (hidden comment: IND_COILCRAFT_XAL7030)
LED2  value GREEN  [SM/LED_0603]  (hidden comment: LED_0603)
LED3  value GREEN  [SM/LED_0603]  (hidden comment: LED_0603)
Q5  value MMBT3904  [SM/SOT23_A]  (hidden comment: TRANSISTOR_NPN_SOT23)
Q6  value MMBT3904  [SM/SOT23_A]  (hidden comment: TRANSISTOR_NPN_SOT23)
Q7  value P-CH  [SM/POWERPAK/VISHAY/SO-8]  (hidden comment: MOSFET P-CH 20V 60A PPAK SO-8)
Q8  value BSS138W  [SM/SOT323_A]  (hidden comment: FET_N-CHANNEL_SC70)
R55  value 39  [SM/0402/RES]  (hidden comment: RES_0402_A)
R56  value 39  [SM/0402/RES]  (hidden comment: RES_0402_A)
R57  value 39  [SM/0402/RES]  (hidden comment: RES_0402_A)
R58  value 39  [SM/0402/RES]  (hidden comment: RES_0402_A)
R59  value 39  [SM/0402/RES]  (hidden comment: RES_0402_A)
R60  value 100K  [SM/0402/RES]  (hidden comment: RES_0402_A)
R61  value 39  [SM/0402/RES]  (hidden comment: RES_0402_A)
R62  value 4.7K  [SM/0402/RES]  (hidden comment: RES_0402_A)
R63  value 10K  [SM/0402/RES]  (hidden comment: RES_0402_A)
R64  value 10K  [SM/0402/RES]  (hidden comment: RES_0402_A)
R65  value 240  [SM/0402/RES]  (hidden comment: RES_0402_A)
R66  value 120K  [SM/0402/RES]  (hidden comment: RES_0402_A)
R67  value 78.7K  [SM/0402/RES]  (hidden comment: RES_0402_A)
R68  value 100K  [SM/0402/RES]  (hidden comment: RES_0402_A)
R69  value 240  [SM/0402/RES]  (hidden comment: RES_0402_A)
R70  value 100K  [SM/0402/RES]  (hidden comment: RES_0402_A)
R71  value 140K  [SM/0402/RES]  (hidden comment: RES_0402_A)
R72  value 78.7K  [SM/0402/RES]  (hidden comment: RES_0402_A)
R73  value 200k  [SM/0402/RES]  (hidden comment: RES_0402_A)
R74  value 64.9K  [SM/0402/RES]  (hidden comment: RES_0402_A)
R75  value 200k  [SM/0402/RES]  (hidden comment: RES_0402_A)
R76  value 64.9K  [SM/0402/RES]  (hidden comment: RES_0402_A)
R77  value 10K  [SM/0402/RES]  (hidden comment: RES_0402_A)
R78  value 10K  [SM/0402/RES]  (hidden comment: RES_0402_A)
R79  value 10K  [SM/0402/RES]  (hidden comment: RES_0402_A)
R80  value DNP  [SM/0402/RES]  (hidden comment: RES_0402_A)
R81  value 0  [SM/0805/RES]  (hidden comment: RES_0805_A)
R82  value 52.3K  [SM/0402/RES]  (hidden comment: RES_0402_A)
R83  value 1K  [SM/0402/RES]  (hidden comment: RES_0402_A)
R84  value 2K  [SM/0402/RES]  (hidden comment: RES_0402_A)
R85  value 100K  [SM/0402/RES]  (hidden comment: RES_0402_A)
R86  value 10K  [SM/0402/RES]  (hidden comment: RES_0402_A)
R87  value 16.9K  [SM/0402/RES]  (hidden comment: RES_0402_A)
R88  value 10K  [SM/0402/RES]  (hidden comment: RES_0402_A)
SW1  value TL3301NF160QG  [SM/SWITCH/E-SWITCH/SPST]  (hidden comment: SWITCH_E-SWITCH_TACTILE_SPST)
SW2  value SPDT  [SWITCH/NIDEC/SPDT/AS1D-2M-10-Z]  (hidden comment: AS1D-2M-10-Z)
TP11  TESTPOINT_030  [SM/TESTPOINT/30MIL]  (value not drawn)  (no BOM)
TP12  TESTPOINT_030  [SM/TESTPOINT/30MIL]  (value not drawn)  (no BOM)
U9  value JTAG-SMT3-NC  [SM/MODULE/DIGILENT/JTAG-SMT3]  (hidden comment: MODULE_JTAG-SMT3-NC_18P)
U12  value CDSOT23-SR208  [SM/SOT23-6_C]  (hidden comment: TVS_CDSOT23_SOT23-6_C)
U13  value ADP3338  [SM/SOT223-3_B]  (hidden comment: REG_ADP3338_SOT223-3)
U14  value ADP3334  [SM/DFN8/3x3MM_B]  (hidden comment: REG_ADP334_DFN-8)
U15  value ADP3334  [SM/DFN8/3x3MM_B]  (hidden comment: REG_ADP334_DFN-8)
U16  value ADP3334  [SM/DFN8/3x3MM_B]  (hidden comment: REG_ADP334_DFN-8)
U17  value ADP3334  [SM/DFN8/3x3MM_B]  (hidden comment: REG_ADP334_DFN-8)
U18  value TPS54561DPRR  [SM/WSON10/4x4MM_A]  (hidden comment: REG_TPS54561_WSON-10)

### Ports
PS_DONE (in), PS_JTAG_TCK (bidir), PS_JTAG_TDI (bidir), PS_JTAG_TDO (bidir), PS_JTAG_TMS (bidir), PS_SRST_N (out), PWR_GOOD (in), UART0_RX (out), UART0_TX (in)

### Nets
GND: C73.1(N1) C74.1(N1) C75.2(N2) C76.2(N2) C77.2(N2) C78.2(N2) C79.2(N2) C80.2(N2) C82.2(N2) C83.2(N2) C85.2(N2) C86.2(N2) C88.2(N2) C89.2(N2) C91.2(N2) C92.2(N2) C93.2(N2) C94.2(N2) C95.2(N2) C97.1(N1) C98.2(N2) C99.2(N2) C100.2(N2) C101.1(N1) C102.1(N1) C103.2(N2) C104.2(N2) D1.2(A) J1.1 J24.1 J24.3 J24.5 J24.7 J24.9 J24.11 J24.13 J25.2 J25.3 J26.5(GND) J26.SH J26.TH Q5.2(E) Q6.2(E) Q8.2(SOURCE) R64.2 R67.1 R72.1 R74.1 R76.1 R80.1 R85.2 R86.2 R88.2 SW1.3 SW1.4 SW2.3 U9.1(GND) U9.7(GND) U9.14(GND) U12.5(REF_2) U13.1(GND) U14.5(GND) U14.6(SD) U15.5(GND) U15.6(SD) U16.5(GND) U16.6(SD) U17.5(GND) U17.6(SD) U18.8(GND) U18.11(PAD)
VCC1V8: C79.1(N1) J24.2 R60.2 U9.8(VREF_JTAG)
VCC3V3: C75.1(N1) C76.1(N1) C78.1(N1) R63.1 R65.1 R69.1 U9.2(VREF_UART) U9.15(VDD) U13.2(OUT)
VCC3V3_DP: C84.1(N1) C85.1(N1) R71.2 U15.1(OUT) U15.2(OUT)
VCC4V8_LNA0: C87.1(N1) C88.1(N1) R73.2 U16.1(OUT) U16.2(OUT)
VCC4V8_LNA1: C90.1(N1) C91.1(N1) R75.2 U17.1(OUT) U17.2(OUT)
VCC5V0: C77.1(N1) C80.1(N1) C83.1(N1) C86.1(N1) C89.1(N1) C104.1(N1) J1.2 R77.1 R81.2 U13.3(IN) U14.7(IN) U14.8(IN) U14.9(VCC_EPAD) U15.7(IN) U15.8(IN) U15.9(VCC_EPAD) U16.7(IN) U16.8(IN) U16.9(VCC_EPAD) U17.7(IN) U17.8(IN) U17.9(VCC_EPAD)
VCC_RFCLK: C81.1(N1) C82.1(N1) R66.2 U14.1(OUT) U14.2(OUT)
PS_DONE: R68.2 ; port PS_DONE
PS_JTAG_TCK: R56.1 U9.10(TCK) ; port PS_JTAG_TCK
PS_JTAG_TDI: R58.1 U9.12(TDI) ; port PS_JTAG_TDI
PS_JTAG_TDO: R57.1 U9.11(TDO) ; port PS_JTAG_TDO
PS_JTAG_TMS: R55.1 U9.13(TMS) ; port PS_JTAG_TMS
PS_SRST_N: R59.1 R60.1 R61.2 U9.9(PS_SRST_B) ; port PS_SRST_N
PWR_GOOD: R70.2 ; port PWR_GOOD
UART0_RX: U9.6(TXD) ; port UART0_RX
UART0_TX: R63.2 U9.5(RXD) ; port UART0_TX
USB_JTAG_N: J26.2(D-) U9.16(USB_DM) U12.3(I/O_2)
USB_JTAG_P: J26.3(D+) U9.17(USB_DP) U12.4(I/O_3)
NetC73_2: C73.2(N2) C74.2(N2) C92.1(N1) C93.1(N1) L11.2(N2) R79.2 U18.2(VIN)
NetC81_2: C81.2(N2) R66.1 R67.2 U14.3(FB)
NetC84_2: C84.2(N2) R71.1 R72.2 U15.3(FB)
NetC87_2: C87.2(N2) R73.1 R74.2 U16.3(FB)
NetC90_2: C90.2(N2) R75.1 R76.2 U17.3(FB)
NetC94_1: C94.1(N1) J25.1 Q7.1(SOURCE) Q7.2(SOURCE) Q7.3(SOURCE) R78.1 R84.1
NetC95_1: C95.1(N1) L11.1(N1) Q7.5(DRAIN)
NetC96_1: C96.1(N1) U18.1(BOOT)
NetC96_2: C96.2(N2) D1.1(K) L12.1(N1) U18.9(SW)
NetC97_2: C97.2(N2) C98.1(N1) C99.1(N1) C100.1(N1) L12.2(N2) R81.1 R82.2 TP12.1(N1)
NetC101_2: C101.2(N2) U18.4(SS/TR)
NetC102_2: C102.2(N2) R87.2 U18.7(COMP)
NetC103_1: C103.1(N1) R87.1
NetJ24_4: J24.4 R55.2
NetJ24_6: J24.6 R56.2
NetJ24_8: J24.8 R57.2
NetJ24_10: J24.10 R58.2
NetJ24_14: J24.14 R59.2
NetJ26_1: J26.1(Vbus) R62.1 U12.2(REF_1)
NetJ26_4: J26.4(ID) U12.6(I/O_4)
NetLED2_1: LED2.1(C) Q5.3(C)
NetLED2_2: LED2.2(A) R65.2
NetLED3_1: LED3.1(C) Q6.3(C)
NetLED3_2: LED3.2(A) R69.2
NetQ5_1: Q5.1(B) R68.1
NetQ6_1: Q6.1(B) R70.1
NetQ7_4: Q7.4(GATE) R78.2 R83.1
NetQ8_1: Q8.1(GATE) R88.1 SW2.2
NetQ8_3: Q8.3(DRAIN) R83.2
NetR61_1: R61.1 SW1.1 SW1.2
NetR62_2: R62.2 R64.1 U9.18(DET)
NetR77_2: R77.2 TP11.1(N1) U18.10(PWRGD)
NetR79_1: R79.1 R80.2 U18.3(EN)
NetR82_1: R82.1 R86.1 U18.6(FB)
NetR84_2: R84.2 SW2.1
NetR85_1: R85.1 U18.5(RT/CLK)

Not connected (* = marked no-connect by the designer): J1 3*; J24 12*; U9 3(CTS)* 4(RTS)*; U12 1(I/O_1)*; U14 4(NC)*; U15 4(NC)*; U16 4(NC)*; U17 4(NC)*

### Layout directives
net class USB_JTAG_BUS: USB_JTAG_N, USB_JTAG_P
net class JTAG_BUS: PS_JTAG_TCK, PS_JTAG_TDI, PS_JTAG_TDO, PS_JTAG_TMS, PS_SRST_N
differential pair; Impedance: 90 Ohms; differential pair class 95OHM_DIFF: USB_JTAG_N, USB_JTAG_P

### Notes on the sheet
- (near L11) POWER SUPPLY
- VCC5V0:
  5.0V @ 3.5A max
- 1MHz
- 5V (5A Rated)
- (near SW1) SOM PS RESET
- Keyed Fan Header
- JTAG / UART
- LAYOUT NOTE: USB_JTAG_BUS Signal Group
  - All signals should be routed as striplines.
  - No more than 2 transitions (vias) allowed for each pair.
  - 95±10% ohm differential impedance.
  - The maximum skew between a given differential pair
  must be less than 8ps.
  - All signals should maintain a minimum of 30mil spacing
  to other signals.
- (near R68) LAYOUT NOTE: JTAG_BUS Signal Group
  - The maximum skew between signals must be less than 50ps.
  - All signals should maintain a minimum of 30mil spacing to
  other signals outside this signal group.
- VCC_RFCLK:
  3.0V @ 0.5A max
- VCC4V8_LNA0:
  4.8V @ 115mA Typ
- Reference designs ARE PROVIDED "AS IS" AND "WITH ALL FAULTS."
- NextGen DISCLAIMS ALL OTHER WARRANTIES, EXPRESS OR IMPLIED,
- NextGen may make changes to specifications and product descriptions at
- NextGen RF Design
- VCC3V3_DP:
  3.3V @ 0.5A max
- any time without notice. The Customer must not REGARDING PRODUCTS,
- INCLUDING BUT NOT LIMITED TO, ANY IMPLIED WARRANTIES OF
- MECHANTABILITY OR FITNESS FOR A PATICULAR PURPOSE reley on
- "reserved" or "undefined."  NextGen reserves these for future definition and
- the absence of characteristics of any features or instructions marked
- shall have no responsibility whatsoever for conflicts or incompatibilities
- 2130 Howard Dr W
- North Mankato, MN 56003
- ENGINEER:
- Site or Materials is subject to change without notice. Do Not finalize a design
- with this information.
- arising from future changes to them.  The product information on the Web
- ELLIOTT NELSON
- CUSTOMER:
- PROJECT:
- VCC3V3:
  3.3V @ 1A max
- VCC4V8_LNA1:
  4.8V @ 115mA Typ
- SYSTEM ENGINEER:
- DATE:
- LUKE THOLEN
- SIZE
- PAGE TITLE:
- VARIANT:
- SHEET
- OF
- REV:
- B
- (in symbol CON_USB_MICRO-B_RA) MICRO-B
- (in symbol FET_N-CHANNEL_SC70) D; G; S
- (in symbol FET_P-CHANNEL_PPAK-SO-8) 1,2,3

### Library data of the parts
C73 C74 C97 = CAP_CERAMIC_0402: CAP CER 1000PF 50V C0G/NP0 0402; TOL: 1%; OEM#: GRM1555C1H102FA01D; OEM NAME: Murata Electronics; VOLT: 50V
C75 C76 C82 C85 C88 C91 = CAP_CERAMIC_0402: as C67 on sheet 6-User IO; VOLT: 10V
C77 C80 C83 C86 C89 = CAP_CERAMIC_0402: 10µF ±20% 10V Ceramic Capacitor X5R 0402 (1005 Metric); OEM#: CL05A106MP8NUB8; OEM NAME: Samsung; TOL: ±20%; VOLT: 10V
C78 C79 C81 C84 C87 C90 = CAP_CERAMIC_0402: as C51-C64 on sheet 5-DisplayPort & Ethernet; VOLT: 25V
C92 C93 = CAP_CERAMIC_0805: CAP CER 10UF 35V X5R 0805; OEM#: GRM21BR6YA106ME43L; OEM NAME: Murata Electronics; TOL: 20%
C94 = CAP_CERAMIC_0805: CAP CER 10UF 35V X5R 0805; OEM#: GMK212BBJ106MG-T; OEM NAME: Taiyo Yuden; TOL: 20%
C95 C104 = CAP_CERAMIC_0603: TOL: 10%; OEM#: GRT188R61H105KE13D; OEM NAME: Murata; VOLT: 50V
C96 = CAP_CERAMIC_0402: CAP CER 0.1UF 50V X7R 0402; TOL: 10%; OEM#: CGA2B3X7R1H104K050BB; OEM NAME: TDK Corporation
C98-C100 = CAP_CERAMIC_0805: CAP CER 22UF 16V X5R 0805; OEM#: GRM219R61C226ME15L; OEM NAME: Murata Electronics; TOL: 20%; VOLT: 16V
C101 = CAP_CERAMIC_0402: CAP CER 10000PF 50V X7R 0402; TOL: 10%; OEM#: GCM155R71H103KA55J; OEM NAME: Murata Electronics; VOLT: 50V
C102 = CAP_CERAMIC_0402: CAP CER 47PF 50V C0G/NP0 0402; TOL: 5%; OEM#: GCM1555C1H470JA16D; OEM NAME: Murata Electronics; VOLT: 50V
C103 = CAP_CERAMIC_0402: CAP CER 4700PF 50V X7R 0402; TOL: 10%; OEM#: GRM155R71H472KA01J; OEM NAME: Murata
D1 = DIODE_SCHOTTKY SMB: DIODE SCHOTTKY 60V 5A SMB; OEM NAME: STMicroelectronics; OEM#: STPS5L60U
J1 = CON_100SP_1X3P_MLX_KK100: Connector Header Through Hole 3 position 0.100" (2.54mm).  Molex KK 100 Series.; OEM#: 0022112032; OEM NAME: MOLEX; VALUE: 0022112032
J24 = CON_MOLEX_0878321420_14P: Connector Header Surface Mount 14 position 0.079" (2.00mm); OEM NAME: MOLEX; OEM#: 0878321420
J25 = CON_WURTH_694106301002: Wurth DC power jack, 2.1mm pin, right angle; OEM#: 694106301002; OEM NAME: WURTH
J26 = CON_USB_MICRO-B_RA: USB MICRO-B RIGHT ANGLE, MOLEX 1051640001; OEM NAME: Molex, LLC; OEM#: 1051640001
L11 = IND_COILCRAFT_XAL4020: Fixed Inductors 4.7uH 20% 5.1A 44.1mOhms AEC-Q200; OEM#: XAL4030-472MEC; OEM NAME: Coilcraft
L12 = IND_COILCRAFT_XAL7030: OEM#: XAL7030-562MEC; OEM NAME: Coilcraft
LED2 LED3 = LED_0603: LED-0603; OEM#: LG L29K-F2J1-24-Z; OEM NAME: OSRAM
Q5 Q6 = TRANSISTOR_NPN_SOT23: as Q3 on sheet 5-DisplayPort & Ethernet
Q7 = FET_P-CHANNEL_PPAK-SO-8: P-Channel 20 V 60A (Tc) 6.25W (Ta), 104W (Tc) Surface Mount PowerPAK® SO-8; OEM NAME: VISHAY SILICONIX; OEM#: SI7157DP-T1-GE3
Q8 = FET_N-CHANNEL_SC70: FET, N-Channel, SC70/SOT323; OEM NAME: ON Semi; OEM#: BSS138W
R55-R59 R61 = RES_0402_A: as R37 on sheet 5-DisplayPort & Ethernet; TOL: 1%
R60 R68 R70 R85 = RES_0402_A: as R38 on sheet 5-DisplayPort & Ethernet; TOL: 1%
R62 = RES_0402_A: as R35 on sheet 5-DisplayPort & Ethernet; TOL: 1%
R63 R64 = RES_0402_A: OEM#: ERJ-2RKF1002X; OEM NAME: Panasonic; TOL: ±1%
R65 R69 = RES_0402_A: as R51 on sheet 5-DisplayPort & Ethernet; TOL: 1%
R66 = RES_0402_A: RES 120K OHM 1% 1/10W 0402 SMD; OEM#: ERJ-2RKF1203X; OEM NAME: Panasonic; TOL: ±1%
R67 R72 = RES_0402_A: RES SMD 78.7K OHM 1% 1/10W 0402; OEM#: ERJ-2RKF7872X; OEM NAME: Panasonic; TOL: ±1%
R71 = RES_0402_A: RES SMD 140K OHM 1% 1/10W 0402; OEM#: ERJ-2RKF1403X; OEM NAME: Panasonic; TOL: ±1%
R73 R75 = RES_0402_A: RES SMD 200K OHM 1% 1/10W 0402; OEM#: ERJ-2RKF2003X; OEM NAME: Panasonic; TOL: ±1%
R74 R76 = RES_0402_A: RES SMD 64.9K OHM 1% 1/10W 0402; OEM#: ERJ-2RKF6492X; OEM NAME: Panasonic; TOL: ±1%
R77-R79 R86 R88 = RES_0402_A: RES SMD 10K OHM 1% 1/10W 0402; OEM#: ERJ-2RKF1002X; OEM NAME: Panasonic; TOL: 1%
R80 = RES_0402_A: DNP; OEM NAME: Panasonic; OEM#: DNP
R81 = RES_0805_A: RES SMD 0 OHM JUMPER 1/8W 0805; OEM#: ERJ-6GEY0R00V; OEM NAME: Panasonic
R82 = RES_0402_A: RES SMD 52.3K OHM 1% 1/10W 0402; OEM#: ERJ-2RKF5232X; OEM NAME: Panasonic; TOL: 1%
R83 = RES_0402_A: RES SMD 1K OHM 1% 1/10W 0402; OEM#: ERJ-2RKF1001X; OEM NAME: Panasonic; TOL: ±1%
R84 = RES_0402_A: RES SMD 2 KOHM 1% 1/5W 0402; OEM#: ERJ-PA2F2001X; OEM NAME: Panasonic Electronic Components; TOL: 1%
R87 = RES_0402_A: RES SMD 16.9K OHM 1% 1/10W 0402; OEM#: ERJ-2RKF1692X; OEM NAME: Panasonic; TOL: 1%
SW1 = SWITCH_E-SWITCH_TACTILE_SPST: Tactile Switch SPST-NO Top Actuated Surface Mount; OEM#: TL3301NF160QG; OEM NAME: E-SWITCH
SW2 = SWITCH_SLIDE_NIDEC_SPDT: SWITCH SLIDE SPDT 50MA 48V; OEM NAME: Nidec Copal Electronics; OEM#: AS1D-2M-10-Z
U9 = MODULE_JTAG-SMT3-NC_18P: SMT Programming module for Xilinx FPGAs.; OEM NAME: DIGILENT; OEM#: JTAG-SMT3-NC
U12 = TVS_CDSOT23_SOT23-6_C: Clamp Ipp Tvs Diode Surface Mount SOT-23-6.; OEM NAME: Bourns Inc.; OEM#: CDSOT23-SR208
U13 = REG_ADP3338_SOT223-3: Linear Voltage Regulator IC 3.3V Output 1A SOT-223-3; OEM NAME: ANALOG DEVICES; OEM#: ADP3338AKCZ-3.3-RL
U14-U17 = REG_ADP334_DFN-8: Linear Voltage Regulator IC  1 Output  500mA 8-LFCSP-WD (3x3); OEM#: ADP3334ACPZ-REEL7; OEM NAME: ANALOG DEVICES
U18 = REG_TPS54561_WSON-10: 4.5-V to 60-V Input, 5-A, Step-Down DC-DC Converter with Soft-Start and Eco-mode; OEM NAME: Texas Instruments; OEM#: TPS54561DPRR

## Nets that join several sheets
GND: 2-SOM Interface (56 pins), 3-RF Frontend (65 pins), 4-USB & SATA (32 pins), 5-DisplayPort & Ethernet (32 pins), 6-User IO (24 pins), 7-JTAG & Power (71 pins)
VCC1V8: 2-SOM Interface (C4.1 P1.119), 4-USB & SATA (C43.1 L10.1), 6-User IO (8 pins), 7-JTAG & Power (C79.1 J24.2 R60.2 U9.8)
VCC3V3: 2-SOM Interface (C1.1 P2.21), 4-USB & SATA (5 pins), 5-DisplayPort & Ethernet (8 pins), 6-User IO (13 pins), 7-JTAG & Power (9 pins)
VCC3V3_DP: 5-DisplayPort & Ethernet (6 pins), 7-JTAG & Power (5 pins)
VCC4V8_LNA0: 3-RF Frontend (C5.1 L1.1), 7-JTAG & Power (5 pins)
VCC4V8_LNA1: 3-RF Frontend (C18.1 L7.1), 7-JTAG & Power (5 pins)
VCC5V0: 2-SOM Interface (14 pins), 4-USB & SATA (C33.1 JP1.3 U5.7), 7-JTAG & Power (22 pins)
VCC_RFCLK: 3-RF Frontend (12 pins), 7-JTAG & Power (5 pins)
AGPIO_1: 2-SOM Interface (P2.16), 6-User IO (J22.7)
AGPIO_2: 2-SOM Interface (P2.09), 6-User IO (J22.8)
AGPIO_3: 2-SOM Interface (P2.18), 6-User IO (J22.9)
AGPIO_4: 2-SOM Interface (P2.11), 6-User IO (J22.10)
AGPIO_5: 2-SOM Interface (P2.20), 3-RF Frontend (R11.1), 6-User IO (J22.11)
AGPIO_6: 2-SOM Interface (P2.13), 3-RF Frontend (R3.1), 6-User IO (J22.12)
AUXADC_0: 2-SOM Interface (P2.10), 6-User IO (J22.3)
AUXADC_1: 2-SOM Interface (P2.12), 6-User IO (J22.4)
ETH_LED0: 2-SOM Interface (P1.81), 5-DisplayPort & Ethernet (R52.2)
ETH_LED1: 2-SOM Interface (P1.79), 5-DisplayPort & Ethernet (R54.2)
ETH_MD1_N: 2-SOM Interface (P1.50), 5-DisplayPort & Ethernet (J21.10)
ETH_MD1_P: 2-SOM Interface (P1.52), 5-DisplayPort & Ethernet (J21.11)
ETH_MD2_N: 2-SOM Interface (P1.43), 5-DisplayPort & Ethernet (J21.5)
ETH_MD2_P: 2-SOM Interface (P1.45), 5-DisplayPort & Ethernet (J21.4)
ETH_MD3_N: 2-SOM Interface (P1.37), 5-DisplayPort & Ethernet (J21.2)
ETH_MD3_P: 2-SOM Interface (P1.39), 5-DisplayPort & Ethernet (J21.3)
ETH_MD4_N: 2-SOM Interface (P1.44), 5-DisplayPort & Ethernet (J21.9)
ETH_MD4_P: 2-SOM Interface (P1.46), 5-DisplayPort & Ethernet (J21.8)
GTR_REFCLK0_N: 2-SOM Interface (P1.34), 4-USB & SATA (TP9.1 U6.13)
GTR_REFCLK0_P: 2-SOM Interface (P1.32), 4-USB & SATA (TP5.1 U6.14)
GTR_REFCLK1_N: 2-SOM Interface (P1.31), 4-USB & SATA (TP10.1 U6.12)
GTR_REFCLK1_P: 2-SOM Interface (P1.33), 4-USB & SATA (TP8.1 U6.11)
GTR_REFCLK2_N: 2-SOM Interface (P1.28), 4-USB & SATA (TP6.1 U6.16)
GTR_REFCLK2_P: 2-SOM Interface (P1.26), 4-USB & SATA (TP2.1 U6.17)
GTR_REFCLK3_N: 2-SOM Interface (P1.25), 4-USB & SATA (TP1.1 U6.20)
GTR_REFCLK3_P: 2-SOM Interface (P1.27), 4-USB & SATA (TP3.1 U6.19)
GTR_RX0_N: 2-SOM Interface (P1.22), 4-USB & SATA (J18.10 TVS1.1 TVS1.10)
GTR_RX0_P: 2-SOM Interface (P1.20), 4-USB & SATA (J18.9 TVS1.2 TVS1.9)
GTR_RX1_N: 2-SOM Interface (P1.16), 4-USB & SATA (C34.1)
GTR_RX1_P: 2-SOM Interface (P1.14), 4-USB & SATA (C35.1)
GTR_TX0_N: 2-SOM Interface (P1.21), 4-USB & SATA (C42.1)
GTR_TX0_P: 2-SOM Interface (P1.19), 4-USB & SATA (C41.1)
GTR_TX1_N: 2-SOM Interface (P1.15), 4-USB & SATA (C32.1)
GTR_TX1_P: 2-SOM Interface (P1.13), 4-USB & SATA (C31.1)
GTR_TX2_N: 2-SOM Interface (P1.09), 5-DisplayPort & Ethernet (C55.1)
GTR_TX2_P: 2-SOM Interface (P1.07), 5-DisplayPort & Ethernet (C54.1)
GTR_TX3_N: 2-SOM Interface (P1.03), 5-DisplayPort & Ethernet (C53.1)
GTR_TX3_P: 2-SOM Interface (P1.01), 5-DisplayPort & Ethernet (C52.1)
I2C1_SCL: 2-SOM Interface (R100.1 R102.1), 4-USB & SATA (R33.2 TP7.1 U6.9), 6-User IO (J23.19)
I2C1_SDA: 2-SOM Interface (R101.1 R103.2), 4-USB & SATA (R34.2 TP4.1 U6.8), 6-User IO (J23.21)
IO_L1_N: 2-SOM Interface (P1.61), 6-User IO (U10.3)
IO_L1_P: 2-SOM Interface (P1.63), 6-User IO (U10.1)
IO_L2_N: 2-SOM Interface (P1.57), 6-User IO (U10.5)
IO_L2_P: 2-SOM Interface (P1.55), 6-User IO (U10.4)
IO_L3_N: 2-SOM Interface (P1.51), 6-User IO (U10.7)
IO_L3_P: 2-SOM Interface (P1.49), 6-User IO (U10.6)
IO_L4_N: 2-SOM Interface (P1.69), 6-User IO (U10.9)
IO_L4_P: 2-SOM Interface (P1.67), 6-User IO (U10.8)
IO_L5_N: 2-SOM Interface (P1.75), 6-User IO (U11.3)
IO_L5_P: 2-SOM Interface (P1.73), 6-User IO (U11.1)
IO_L10_N: 2-SOM Interface (P1.70), 6-User IO (U11.5)
IO_L10_P: 2-SOM Interface (P1.68), 6-User IO (U11.4)
IO_L11_N: 2-SOM Interface (P1.64), 6-User IO (U11.7)
IO_L11_P: 2-SOM Interface (P1.62), 6-User IO (U11.6)
IO_L12_N: 2-SOM Interface (P1.56), 6-User IO (U11.9)
IO_L12_P: 2-SOM Interface (P1.58), 6-User IO (U11.8)
MCS_N: 2-SOM Interface (P2.06), 3-RF Frontend (R9.1)
MCS_P: 2-SOM Interface (P2.04), 3-RF Frontend (R8.1)
MIO26: 2-SOM Interface (P1.95), 6-User IO (J23.11)
MIO27: 2-SOM Interface (P1.105), 5-DisplayPort & Ethernet (R40.2)
MIO28: 2-SOM Interface (P1.91), 5-DisplayPort & Ethernet (R49.1)
MIO29: 2-SOM Interface (P1.97), 5-DisplayPort & Ethernet (R39.2)
MIO30: 2-SOM Interface (P1.99), 5-DisplayPort & Ethernet (R42.2)
MIO31: 2-SOM Interface (P1.107), 6-User IO (J23.5)
MIO32: 2-SOM Interface (P1.111), 6-User IO (J23.3)
MIO33: 2-SOM Interface (P1.93), 6-User IO (J23.13)
MIO34: 2-SOM Interface (P1.102), 6-User IO (J23.6)
MIO35: 2-SOM Interface (P1.101), 6-User IO (J23.9)
MIO36: 2-SOM Interface (P1.103), 6-User IO (J23.7)
MIO37: 2-SOM Interface (P1.87), 6-User IO (J23.15)
MIO38: 2-SOM Interface (P1.88), 6-User IO (J23.17)
MIO39: 2-SOM Interface (P1.92), 6-User IO (J23.14)
MIO40: 2-SOM Interface (P1.98), 6-User IO (J23.10)
MIO41: 2-SOM Interface (P1.90), 6-User IO (J23.16)
MIO42: 2-SOM Interface (P1.100), 6-User IO (J23.8)
MIO43: 2-SOM Interface (P1.108), 6-User IO (J23.4)
MIO44: 2-SOM Interface (P1.96), 6-User IO (J23.12)
MIO45: 2-SOM Interface (P1.94), 5-DisplayPort & Ethernet (J19.9 R35.2)
MIO46: 2-SOM Interface (P1.89), 5-DisplayPort & Ethernet (J19.7)
MIO47: 2-SOM Interface (P1.104), 5-DisplayPort & Ethernet (J19.8)
MIO48: 2-SOM Interface (P1.106), 5-DisplayPort & Ethernet (J19.1)
MIO49: 2-SOM Interface (P1.109), 5-DisplayPort & Ethernet (J19.2)
MIO50: 2-SOM Interface (P1.110), 5-DisplayPort & Ethernet (J19.3 R36.2)
MIO51: 2-SOM Interface (P1.112), 5-DisplayPort & Ethernet (R37.2)
PS_DONE: 2-SOM Interface (P1.113), 7-JTAG & Power (R68.2)
PS_JTAG_TCK: 2-SOM Interface (P1.114), 7-JTAG & Power (R56.1 U9.10)
PS_JTAG_TDI: 2-SOM Interface (P1.116), 7-JTAG & Power (R58.1 U9.12)
PS_JTAG_TDO: 2-SOM Interface (P1.118), 7-JTAG & Power (R57.1 U9.11)
PS_JTAG_TMS: 2-SOM Interface (P1.120), 7-JTAG & Power (R55.1 U9.13)
PS_SRST_N: 2-SOM Interface (P1.115), 7-JTAG & Power (R59.1 R60.1 R61.2 U9.9)
PWR_GOOD: 2-SOM Interface (P1.117), 7-JTAG & Power (R70.2)
RF_CLK_N: 2-SOM Interface (P2.03), 3-RF Frontend (R20.1)
RF_CLK_P: 2-SOM Interface (P2.05), 3-RF Frontend (R21.1)
UART0_RX: 2-SOM Interface (P1.84), 7-JTAG & Power (U9.6)
UART0_TX: 2-SOM Interface (P1.80), 7-JTAG & Power (R63.2 U9.5)
UART1_RX: 2-SOM Interface (P1.86), 6-User IO (J23.18)
UART1_TX: 2-SOM Interface (P1.82), 6-User IO (J23.20)
USB_CPEN: 2-SOM Interface (P1.76), 4-USB & SATA (R29.2 U5.1)
USB_ID: 2-SOM Interface (P1.78), 4-USB & SATA (JP4.2)
USB_N: 2-SOM Interface (P1.38), 4-USB & SATA (J18.2 TVS2.1)
USB_P: 2-SOM Interface (P1.40), 4-USB & SATA (J18.3 TVS2.2)
USB_VBUS: 2-SOM Interface (P1.74), 4-USB & SATA (JP3.2)